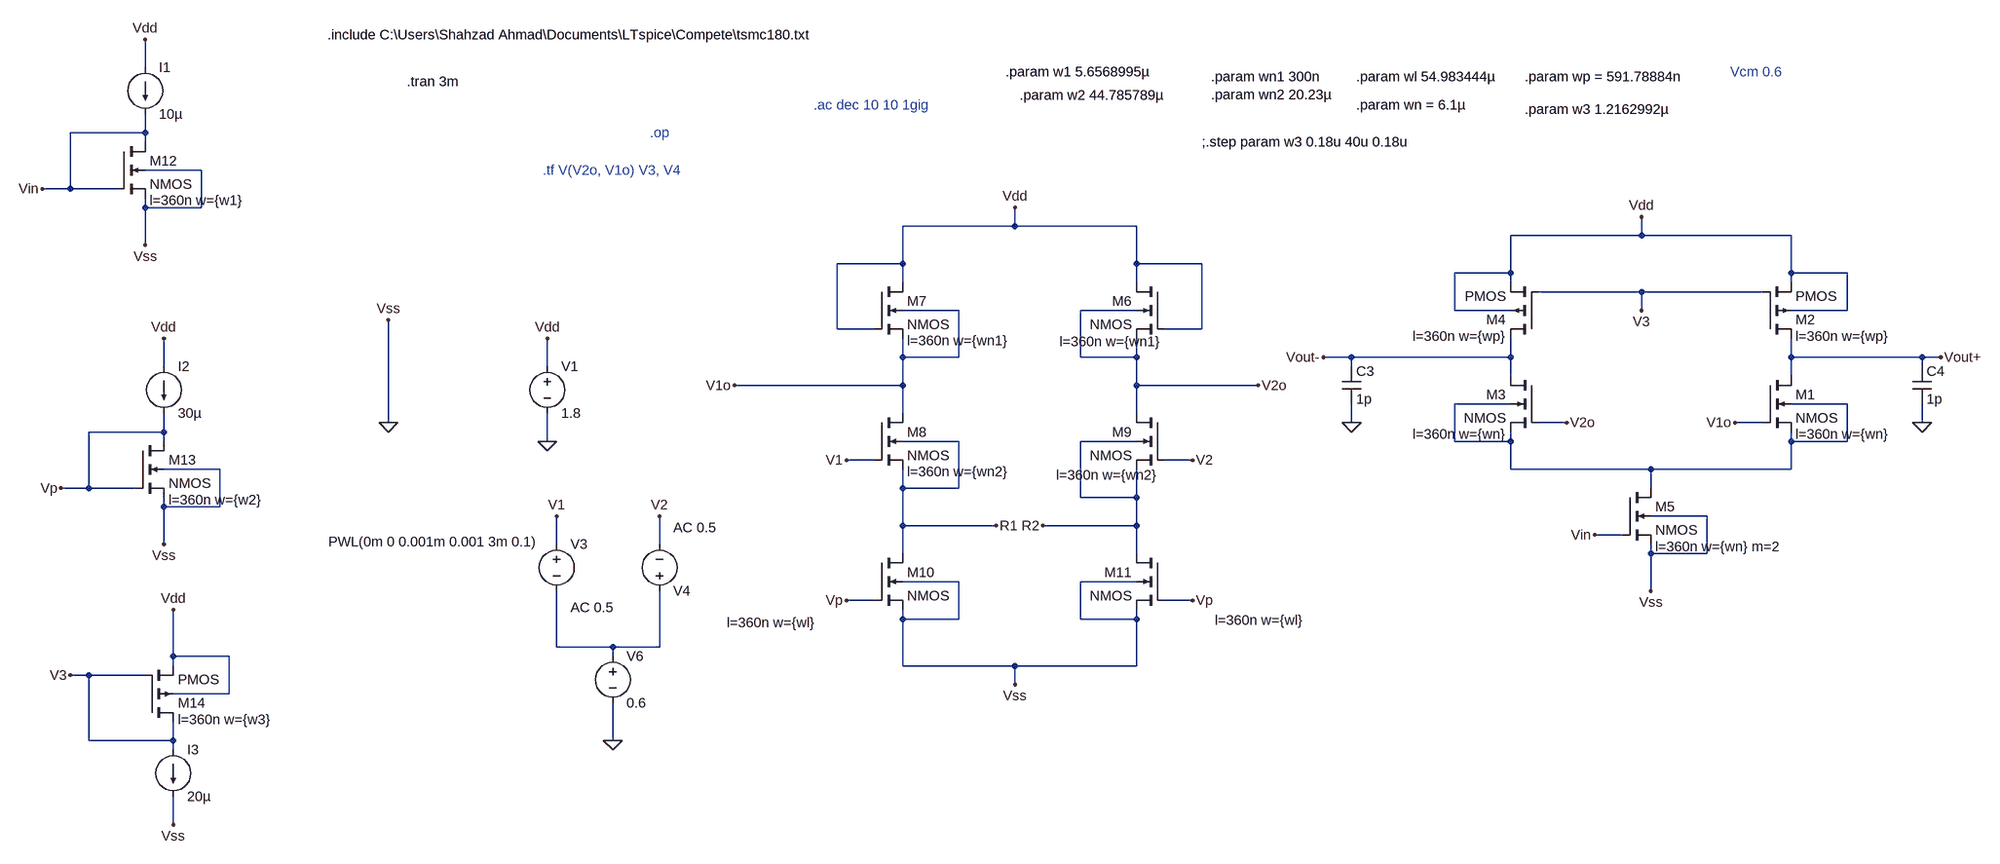
[diagram p0: schematic t_cell.asc]
t_cell.asc, the LTspice schematic file:
Version 4
SHEET 1 880 1220
WIRE -2864 -160 -2864 -208
WIRE -2864 -48 -2864 -80
WIRE -2864 -48 -2992 -48
WIRE -2864 -32 -2864 -48
WIRE -2768 16 -2864 16
WIRE -2992 48 -2992 -48
WIRE -2992 48 -3040 48
WIRE -2912 48 -2992 48
WIRE -2864 80 -2864 64
WIRE -2768 80 -2768 16
WIRE -2768 80 -2864 80
WIRE -1376 112 -1376 80
WIRE -1376 112 -1568 112
WIRE -1168 112 -1376 112
WIRE -304 128 -304 96
WIRE -304 128 -528 128
WIRE -48 128 -304 128
WIRE -2864 144 -2864 80
WIRE -1568 176 -1568 112
WIRE -1568 176 -1680 176
WIRE -1168 176 -1168 112
WIRE -1056 176 -1168 176
WIRE -528 192 -528 128
WIRE -528 192 -624 192
WIRE -48 192 -48 128
WIRE 48 192 -48 192
WIRE -1568 208 -1568 176
WIRE -1168 208 -1168 176
WIRE -528 208 -528 192
WIRE -48 208 -48 192
WIRE -304 224 -480 224
WIRE -96 224 -304 224
WIRE -1472 256 -1568 256
WIRE -1168 256 -1264 256
WIRE -624 256 -624 192
WIRE -528 256 -624 256
WIRE -304 256 -304 224
WIRE 48 256 48 192
WIRE 48 256 -48 256
WIRE -1680 288 -1680 176
WIRE -1616 288 -1680 288
WIRE -1056 288 -1056 176
WIRE -1056 288 -1120 288
WIRE -1568 336 -1568 304
WIRE -1472 336 -1472 256
WIRE -1472 336 -1568 336
WIRE -1264 336 -1264 256
WIRE -1168 336 -1168 304
WIRE -1168 336 -1264 336
WIRE -800 336 -848 336
WIRE -528 336 -528 304
WIRE -528 336 -800 336
WIRE -48 336 -48 304
WIRE 176 336 -48 336
WIRE 208 336 176 336
WIRE -2832 352 -2832 304
WIRE -2176 352 -2176 304
WIRE -800 352 -800 336
WIRE 176 352 176 336
WIRE -528 368 -528 336
WIRE -48 368 -48 336
WIRE -1568 384 -1568 336
WIRE -1568 384 -1856 384
WIRE -1168 384 -1168 336
WIRE -960 384 -1168 384
WIRE -528 416 -624 416
WIRE 48 416 -48 416
WIRE -1568 432 -1568 384
WIRE -1168 432 -1168 384
WIRE -2448 448 -2448 272
WIRE -800 448 -800 416
WIRE -432 448 -480 448
WIRE -96 448 -144 448
WIRE 176 448 176 416
WIRE -2832 464 -2832 432
WIRE -2832 464 -2960 464
WIRE -2832 480 -2832 464
WIRE -2176 480 -2176 432
WIRE -1472 480 -1568 480
WIRE -1168 480 -1264 480
WIRE -624 480 -624 416
WIRE -528 480 -528 464
WIRE -528 480 -624 480
WIRE -48 480 -48 464
WIRE 48 480 48 416
WIRE 48 480 -48 480
WIRE -1616 512 -1664 512
WIRE -1072 512 -1120 512
WIRE -2736 528 -2832 528
WIRE -528 528 -528 480
WIRE -288 528 -528 528
WIRE -48 528 -48 480
WIRE -48 528 -288 528
WIRE -2960 560 -2960 464
WIRE -2960 560 -3008 560
WIRE -2880 560 -2960 560
WIRE -1568 560 -1568 528
WIRE -1472 560 -1472 480
WIRE -1472 560 -1568 560
WIRE -288 560 -288 528
WIRE -1264 576 -1264 480
WIRE -1168 576 -1168 528
WIRE -1168 576 -1264 576
WIRE -2832 592 -2832 576
WIRE -2736 592 -2736 528
WIRE -2736 592 -2832 592
WIRE -192 608 -288 608
WIRE -1568 624 -1568 560
WIRE -1408 624 -1568 624
WIRE -1168 624 -1168 576
WIRE -1168 624 -1328 624
WIRE -336 640 -384 640
WIRE -2832 656 -2832 592
WIRE -2160 656 -2160 608
WIRE -1984 656 -1984 608
WIRE -1568 672 -1568 624
WIRE -1168 672 -1168 624
WIRE -288 672 -288 656
WIRE -192 672 -192 608
WIRE -192 672 -288 672
WIRE -1472 720 -1568 720
WIRE -1168 720 -1264 720
WIRE -288 736 -288 672
WIRE -1616 752 -1664 752
WIRE -1072 752 -1120 752
WIRE -1568 784 -1568 768
WIRE -1472 784 -1472 720
WIRE -1472 784 -1568 784
WIRE -1264 784 -1264 720
WIRE -1168 784 -1168 768
WIRE -1168 784 -1264 784
WIRE -2160 832 -2160 736
WIRE -2064 832 -2160 832
WIRE -1984 832 -1984 736
WIRE -1984 832 -2064 832
WIRE -2816 848 -2816 768
WIRE -2720 848 -2816 848
WIRE -2064 848 -2064 832
WIRE -2816 864 -2816 848
WIRE -1568 864 -1568 784
WIRE -1376 864 -1568 864
WIRE -1168 864 -1168 784
WIRE -1168 864 -1376 864
WIRE -2960 880 -2992 880
WIRE -2864 880 -2960 880
WIRE -1376 896 -1376 864
WIRE -2720 912 -2720 848
WIRE -2720 912 -2816 912
WIRE -2960 992 -2960 880
WIRE -2816 992 -2816 960
WIRE -2816 992 -2960 992
WIRE -2064 992 -2064 928
WIRE -2816 1008 -2816 992
WIRE -2816 1136 -2816 1088
FLAG -304 96 Vdd
FLAG 208 336 Vout+
FLAG -384 640 Vin
FLAG -1376 80 Vdd
FLAG -1664 512 V1
FLAG -1072 512 V2
FLAG -1856 384 V1o
FLAG -960 384 V2o
FLAG -2176 480 0
FLAG -2176 304 Vdd
FLAG -2160 608 V1
FLAG -1984 608 V2
FLAG -1664 752 Vp
FLAG -1072 752 Vp
FLAG -144 448 V1o
FLAG -432 448 V2o
FLAG -2064 992 0
FLAG -2864 -208 Vdd
FLAG -3040 48 Vin
FLAG -2864 144 Vss
FLAG -2832 304 Vdd
FLAG -3008 560 Vp
FLAG -2832 656 Vss
FLAG -2448 448 0
FLAG -2448 272 Vss
FLAG -848 336 Vout-
FLAG -304 256 V3
FLAG -2816 768 Vdd
FLAG -2992 880 V3
FLAG -1376 896 Vss
FLAG -288 736 Vss
FLAG -2816 1136 Vss
FLAG -1408 624 R1
FLAG -1328 624 R2
FLAG -800 448 0
FLAG 176 448 0
DATAFLAG 80 336 ""
DATAFLAG -1056 384 ""
DATAFLAG -1744 384 ""
DATAFLAG -752 336 ""
DATAFLAG -1264 624 ""
SYMBOL nmos4 -96 368 R0
WINDOW 123 56 100 Left 2
SYMATTR Value2 l=360n w={wn}
SYMATTR InstName M1
SYMBOL pmos4 -96 304 M180
WINDOW 123 56 4 Left 2
SYMATTR Value2 l=360n w={wp}
SYMATTR InstName M2
SYMBOL nmos4 -480 368 M0
WINDOW 123 56 100 Left 2
SYMATTR Value2 l=360n w={wn}
SYMATTR InstName M3
SYMBOL pmos4 -480 304 R180
WINDOW 123 56 4 Left 2
SYMATTR Value2 l=360n w={wp}
SYMATTR InstName M4
SYMBOL nmos4 -336 560 R0
WINDOW 123 56 100 Left 2
SYMATTR Value2 l=360n w={wn} m=2
SYMATTR InstName M5
SYMBOL nmos4 -1120 208 M0
WINDOW 123 7 101 Left 2
SYMATTR Value2 l=360n w={wn1}
SYMATTR InstName M6
SYMBOL nmos4 -1616 208 R0
WINDOW 123 56 100 Left 2
SYMATTR Value2 l=360n w={wn1}
SYMATTR InstName M7
SYMBOL nmos4 -1616 432 R0
WINDOW 123 56 100 Left 2
SYMATTR Value2 l=360n w={wn2}
SYMATTR InstName M8
SYMBOL nmos4 -1120 432 M0
WINDOW 123 13 106 Left 2
SYMATTR Value2 l=360n w={wn2}
SYMATTR InstName M9
SYMBOL voltage -2176 336 R0
WINDOW 123 0 0 Left 0
WINDOW 39 0 0 Left 0
SYMATTR InstName V1
SYMATTR Value 1.8
SYMBOL voltage -2160 640 R0
WINDOW 123 24 124 Left 2
WINDOW 39 0 0 Left 0
WINDOW 3 -390 12 Left 2
SYMATTR Value2 AC 0.5
SYMATTR InstName V3
SYMATTR Value PWL(0m 0 0.001m 0.001 3m 0.1)
SYMBOL voltage -1984 752 M180
WINDOW 123 24 124 Left 2
WINDOW 39 0 0 Left 0
SYMATTR Value2 AC 0.5
SYMATTR InstName V4
SYMATTR Value ""
SYMBOL nmos4 -1616 672 R0
WINDOW 123 -253 118 Left 2
SYMATTR Value2 l=360n w={wl}
SYMATTR InstName M10
SYMBOL nmos4 -1120 672 M0
WINDOW 123 -237 114 Left 2
SYMATTR Value2 l=360n w={wl}
SYMATTR InstName M11
SYMBOL voltage -2064 832 R0
WINDOW 123 0 0 Left 0
WINDOW 39 0 0 Left 0
SYMATTR InstName V6
SYMATTR Value 0.6
SYMBOL nmos4 -2912 -32 R0
WINDOW 123 56 100 Left 2
SYMATTR Value2 l=360n w={w1}
SYMATTR InstName M12
SYMBOL current -2864 -160 R0
WINDOW 123 0 0 Left 0
WINDOW 39 0 0 Left 0
SYMATTR InstName I1
SYMATTR Value 10µ
SYMBOL nmos4 -2880 480 R0
WINDOW 123 56 100 Left 2
SYMATTR Value2 l=360n w={w2}
SYMATTR InstName M13
SYMBOL current -2832 352 R0
WINDOW 123 0 0 Left 0
WINDOW 39 0 0 Left 0
SYMATTR InstName I2
SYMATTR Value 30µ
SYMBOL pmos4 -2864 960 M180
WINDOW 123 56 4 Left 2
SYMATTR Value2 l=360n w={w3}
SYMATTR InstName M14
SYMBOL current -2816 1008 R0
WINDOW 123 0 0 Left 0
WINDOW 39 0 0 Left 0
SYMATTR InstName I3
SYMATTR Value 20µ
SYMBOL cap -816 352 R0
SYMATTR InstName C3
SYMATTR Value 1p
SYMBOL cap 160 352 R0
SYMATTR InstName C4
SYMATTR Value 1p
TEXT -1040 -144 Left 2 !.param wn1 300n\n.param wn2 20.23µ
TEXT -792 -96 Left 2 !.param wn = 6.1µ
TEXT -504 -144 Left 2 !.param wp = 591.78884n
TEXT -792 -144 Left 2 !.param wl 54.983444µ
TEXT -1392 -152 Left 2 !.param w1 5.6568995µ
TEXT -1368 -112 Left 2 !.param w2 44.785789µ
TEXT -504 -88 Left 2 !.param w3 1.2162992µ
TEXT -152 -152 Left 2 ;Vcm 0.6
TEXT -2000 -48 Left 2 ;.op
TEXT -2552 -216 Left 2 !.include C:\\Users\\Shahzad Ahmad\\Documents\\LTspice\\Compete\\tsmc180.txt
TEXT -1056 -32 Left 2 !;.step param w3 0.18u 40u 0.18u
TEXT -1720 -96 Left 2 ;.ac dec 10 10 1gig
TEXT -2184 16 Left 2 ;.tf V(V2o, V1o) V3, V4
TEXT -2416 -136 Left 2 !.tran 3m

The netlist it stands for:
* t_cell.asc
M1 Vout+ V1o N001 N001 NMOS l=360n w={wn}
M2 Vout+ V3 Vdd Vdd PMOS l=360n w={wp}
M3 Vout- V2o N001 N001 NMOS l=360n w={wn}
M4 Vout- V3 Vdd Vdd PMOS l=360n w={wp}
M5 N001 Vin 0 0 NMOS l=360n w={wn} m=2
M6 Vdd Vdd V2o V2o NMOS l=360n w={wn1}
M7 Vdd Vdd V1o V1o NMOS l=360n w={wn1}
M8 V1o V1 R1 R1 NMOS l=360n w={wn2}
M9 V2o V2 R2 R2 NMOS l=360n w={wn2}
V1 Vdd 0 1.8
V3 V1 N002 PWL(0m 0 0.001m 0.001 3m 0.1) AC 0.5
V4 N002 V2 AC 0.5
M10 R1 Vp 0 0 NMOS l=360n w={wl}
M11 R2 Vp 0 0 NMOS l=360n w={wl}
V6 N002 0 0.6
M12 Vin Vin 0 0 NMOS l=360n w={w1}
I1 Vdd Vin 10µ
M13 Vp Vp 0 0 NMOS l=360n w={w2}
I2 Vdd Vp 30µ
M14 V3 V3 Vdd Vdd PMOS l=360n w={w3}
I3 V3 0 20µ
C3 Vout- 0 1p
C4 Vout+ 0 1p
.model NMOS NMOS
.model PMOS PMOS
.lib standard.mos
.param wn1 300n
.param wn2 20.23µ
.param wn = 6.1µ
.param wp = 591.78884n
.param wl 54.983444µ
.param w1 5.6568995µ
.param w2 44.785789µ
.param w3 1.2162992µ
* Vcm 0.6
* .op
.include C:\Users\Shahzad Ahmad\Documents\LTspice\Compete\tsmc180.txt
;.step param w3 0.18u 40u 0.18u
* .ac dec 10 10 1gig
* .tf V(V2o, V1o) V3, V4
.tran 3m
.backanno
.end